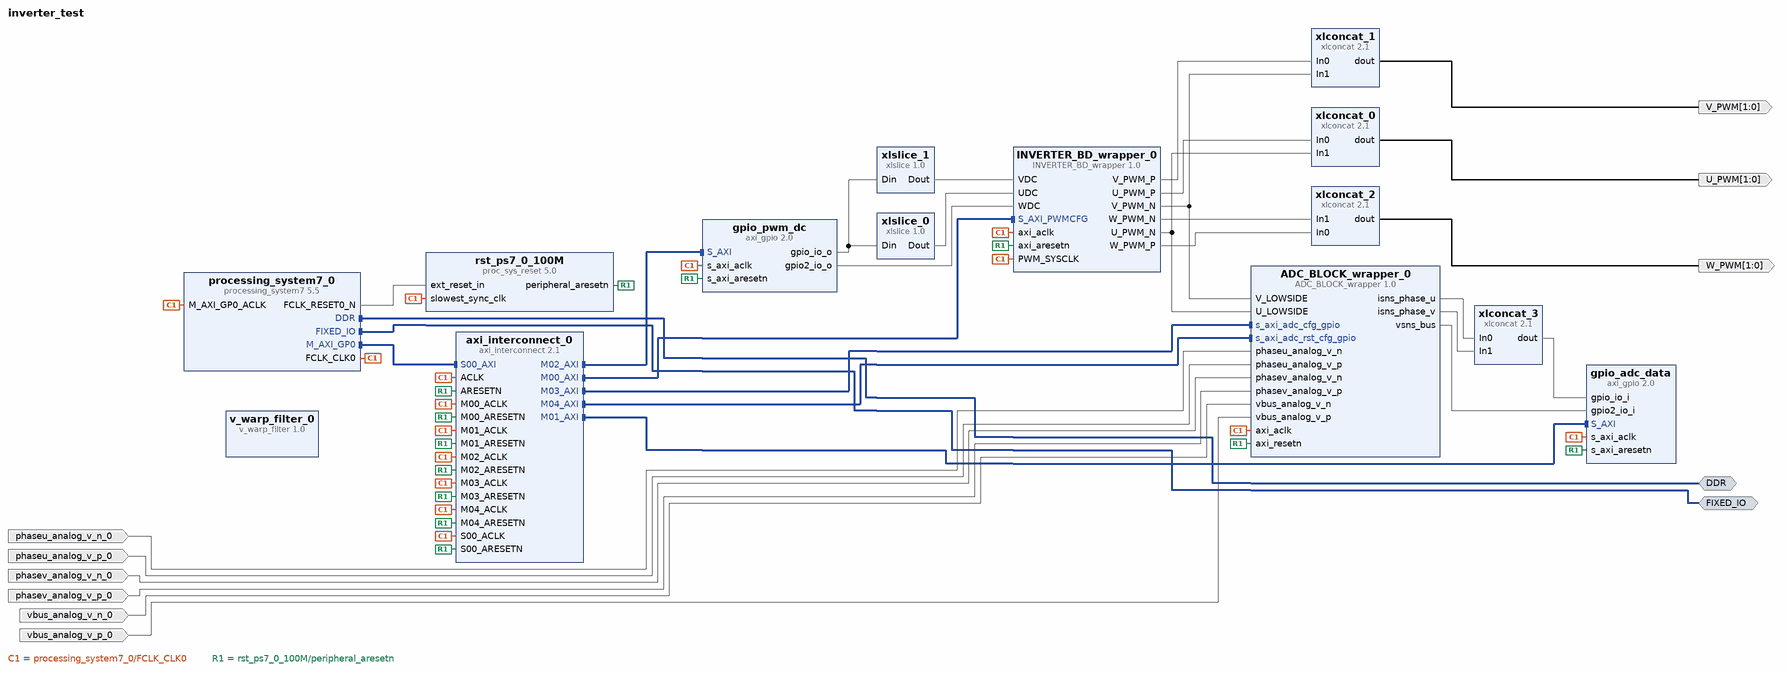
[diagram p0: block diagram of the top level]
# Vivado block design inverter_test, xc7z020clg400-1, Vivado 2021.2
create_bd_design inverter_test

create_bd_intf_port -mode Master -vlnv xilinx.com:interface:ddrx_rtl:1.0 DDR
create_bd_intf_port -mode Master -vlnv xilinx.com:display_processing_system7:fixedio_rtl:1.0 FIXED_IO
create_bd_port -dir O -from 1 -to 0 U_PWM
create_bd_port -dir O -from 1 -to 0 V_PWM
create_bd_port -dir O -from 1 -to 0 W_PWM
create_bd_port -dir I vbus_analog_v_n_0
create_bd_port -dir I phasev_analog_v_p_0
create_bd_port -dir I phasev_analog_v_n_0
create_bd_port -dir I phaseu_analog_v_p_0
create_bd_port -dir I phaseu_analog_v_n_0
create_bd_port -dir I vbus_analog_v_p_0

create_bd_cell -type ip -vlnv xilinx.com:user:INVERTER_BD_wrapper:1.0 INVERTER_BD_wrapper_0
create_bd_cell -type ip -vlnv xilinx.com:ip:xlconcat:2.1 xlconcat_0
create_bd_cell -type ip -vlnv xilinx.com:ip:xlconcat:2.1 xlconcat_1
create_bd_cell -type ip -vlnv xilinx.com:ip:xlconcat:2.1 xlconcat_2
create_bd_cell -type ip -vlnv xilinx.com:ip:processing_system7:5.5 processing_system7_0
set_property -dict [list \
  CONFIG.PCW_APU_PERIPHERAL_FREQMHZ 650 \
  CONFIG.PCW_CRYSTAL_PERIPHERAL_FREQMHZ 50 \
  CONFIG.PCW_ENET0_ENET0_IO {MIO 16 .. 27} \
  CONFIG.PCW_ENET0_GRP_MDIO_ENABLE 1 \
  CONFIG.PCW_ENET0_GRP_MDIO_IO {MIO 52 .. 53} \
  CONFIG.PCW_ENET0_PERIPHERAL_ENABLE 1 \
  CONFIG.PCW_ENET0_RESET_ENABLE 1 \
  CONFIG.PCW_ENET0_RESET_IO {MIO 9} \
  CONFIG.PCW_ENET_RESET_ENABLE 1 \
  CONFIG.PCW_ENET_RESET_SELECT {Share reset pin} \
  CONFIG.PCW_FPGA0_PERIPHERAL_FREQMHZ 100 \
  CONFIG.PCW_FPGA1_PERIPHERAL_FREQMHZ 50 \
  CONFIG.PCW_GPIO_MIO_GPIO_ENABLE 1 \
  CONFIG.PCW_GPIO_MIO_GPIO_IO MIO \
  CONFIG.PCW_I2C_RESET_ENABLE 1 \
  CONFIG.PCW_M_AXI_GP0_FREQMHZ 10 \
  CONFIG.PCW_PERIPHERAL_BOARD_PRESET None \
  CONFIG.PCW_PRESET_BANK1_VOLTAGE {LVCMOS 1.8V} \
  CONFIG.PCW_QSPI_GRP_FBCLK_ENABLE 1 \
  CONFIG.PCW_QSPI_GRP_FBCLK_IO {MIO 8} \
  CONFIG.PCW_QSPI_GRP_SINGLE_SS_ENABLE 1 \
  CONFIG.PCW_QSPI_GRP_SINGLE_SS_IO {MIO 1 .. 6} \
  CONFIG.PCW_QSPI_PERIPHERAL_ENABLE 1 \
  CONFIG.PCW_QSPI_QSPI_IO {MIO 1 .. 6} \
  CONFIG.PCW_SD0_GRP_CD_ENABLE 1 \
  CONFIG.PCW_SD0_GRP_CD_IO {MIO 47} \
  CONFIG.PCW_SD0_GRP_WP_ENABLE 0 \
  CONFIG.PCW_SD0_PERIPHERAL_ENABLE 1 \
  CONFIG.PCW_SD0_SD0_IO {MIO 40 .. 45} \
  CONFIG.PCW_SDIO_PERIPHERAL_FREQMHZ 50 \
  CONFIG.PCW_SINGLE_QSPI_DATA_MODE x4 \
  CONFIG.PCW_UART0_PERIPHERAL_ENABLE 1 \
  CONFIG.PCW_UART0_UART0_IO {MIO 14 .. 15} \
  CONFIG.PCW_UART1_PERIPHERAL_ENABLE 0 \
  CONFIG.PCW_UART_PERIPHERAL_FREQMHZ 100 \
  CONFIG.PCW_UIPARAM_DDR_BUS_WIDTH {16 Bit} \
  CONFIG.PCW_UIPARAM_DDR_FREQ_MHZ 525 \
  CONFIG.PCW_UIPARAM_DDR_PARTNO {MT41J256M16 RE-125} \
  CONFIG.PCW_USB0_PERIPHERAL_ENABLE 1 \
  CONFIG.PCW_USB0_RESET_ENABLE 1 \
  CONFIG.PCW_USB0_RESET_IO {MIO 46} \
  CONFIG.PCW_USB0_USB0_IO {MIO 28 .. 39} \
  CONFIG.PCW_USB_RESET_ENABLE 1 \
  CONFIG.PCW_USB_RESET_SELECT {Share reset pin} \
] [get_bd_cells processing_system7_0]
# 481 more settings of processing_system7_0 are not shown: defaults, MIO pin electricals, DDR timing, and values the tool derives
create_bd_cell -type ip -vlnv xilinx.com:ip:axi_interconnect:2.1 axi_interconnect_0
set_property -dict {CONFIG.NUM_MI 5} [get_bd_cells axi_interconnect_0]
create_bd_cell -type ip -vlnv xilinx.com:ip:proc_sys_reset:5.0 rst_ps7_0_100M
create_bd_cell -type ip -vlnv xilinx.com:ip:axi_gpio:2.0 gpio_adc_data
set_property -dict [list \
  CONFIG.C_ALL_INPUTS 1 \
  CONFIG.C_ALL_INPUTS_2 1 \
  CONFIG.C_GPIO2_WIDTH 16 \
  CONFIG.C_IS_DUAL 1 \
] [get_bd_cells gpio_adc_data]
create_bd_cell -type ip -vlnv xilinx.com:ip:xlconcat:2.1 xlconcat_3
create_bd_cell -type ip -vlnv xilinx.com:ip:axi_gpio:2.0 gpio_pwm_dc
set_property -dict [list \
  CONFIG.C_ALL_OUTPUTS 1 \
  CONFIG.C_ALL_OUTPUTS_2 1 \
  CONFIG.C_GPIO2_WIDTH 16 \
  CONFIG.C_IS_DUAL 1 \
] [get_bd_cells gpio_pwm_dc]
create_bd_cell -type ip -vlnv xilinx.com:ip:xlslice:1.0 xlslice_0
set_property -dict {CONFIG.DIN_FROM 15 CONFIG.DOUT_WIDTH 16} [get_bd_cells xlslice_0]
create_bd_cell -type ip -vlnv xilinx.com:ip:xlslice:1.0 xlslice_1
set_property -dict {CONFIG.DIN_FROM 31 CONFIG.DIN_TO 16 CONFIG.DOUT_WIDTH 16} [get_bd_cells xlslice_1]
create_bd_cell -type ip -vlnv xilinx.com:user:ADC_BLOCK_wrapper:1.0 ADC_BLOCK_wrapper_0
create_bd_cell -type ip -vlnv xilinx.com:ip:v_warp_filter:1.0 v_warp_filter_0

# ---- connections ----

connect_bd_intf_net [get_bd_intf_pins axi_interconnect_0/S00_AXI] [get_bd_intf_pins processing_system7_0/M_AXI_GP0]
connect_bd_intf_net [get_bd_intf_pins axi_interconnect_0/M00_AXI] [get_bd_intf_pins INVERTER_BD_wrapper_0/S_AXI_PWMCFG]
connect_bd_intf_net [get_bd_intf_pins axi_interconnect_0/M01_AXI] [get_bd_intf_pins gpio_adc_data/S_AXI]
connect_bd_intf_net [get_bd_intf_pins axi_interconnect_0/M02_AXI] [get_bd_intf_pins gpio_pwm_dc/S_AXI]
connect_bd_intf_net [get_bd_intf_pins axi_interconnect_0/M03_AXI] [get_bd_intf_pins ADC_BLOCK_wrapper_0/s_axi_adc_cfg_gpio]
connect_bd_intf_net [get_bd_intf_pins axi_interconnect_0/M04_AXI] [get_bd_intf_pins ADC_BLOCK_wrapper_0/s_axi_adc_rst_cfg_gpio]
connect_bd_intf_net [get_bd_intf_ports DDR] [get_bd_intf_pins processing_system7_0/DDR]
connect_bd_intf_net [get_bd_intf_ports FIXED_IO] [get_bd_intf_pins processing_system7_0/FIXED_IO]
connect_bd_net [get_bd_pins ADC_BLOCK_wrapper_0/isns_phase_u] [get_bd_pins xlconcat_3/In0]
connect_bd_net [get_bd_pins ADC_BLOCK_wrapper_0/isns_phase_v] [get_bd_pins xlconcat_3/In1]
connect_bd_net [get_bd_pins ADC_BLOCK_wrapper_0/vsns_bus] [get_bd_pins gpio_adc_data/gpio2_io_i]
connect_bd_net [get_bd_pins INVERTER_BD_wrapper_0/U_PWM_N] [get_bd_pins xlconcat_0/In1] [get_bd_pins ADC_BLOCK_wrapper_0/U_LOWSIDE]
connect_bd_net [get_bd_pins INVERTER_BD_wrapper_0/U_PWM_P] [get_bd_pins xlconcat_0/In0]
connect_bd_net [get_bd_pins INVERTER_BD_wrapper_0/V_PWM_N] [get_bd_pins xlconcat_1/In1] [get_bd_pins ADC_BLOCK_wrapper_0/V_LOWSIDE]
connect_bd_net [get_bd_pins INVERTER_BD_wrapper_0/V_PWM_P] [get_bd_pins xlconcat_1/In0]
connect_bd_net [get_bd_pins INVERTER_BD_wrapper_0/W_PWM_N] [get_bd_pins xlconcat_2/In1]
connect_bd_net [get_bd_pins INVERTER_BD_wrapper_0/W_PWM_P] [get_bd_pins xlconcat_2/In0]
connect_bd_net [get_bd_pins processing_system7_0/FCLK_CLK0] \
  [get_bd_pins INVERTER_BD_wrapper_0/axi_aclk] [get_bd_pins INVERTER_BD_wrapper_0/PWM_SYSCLK] \
  [get_bd_pins rst_ps7_0_100M/slowest_sync_clk] [get_bd_pins axi_interconnect_0/ACLK] \
  [get_bd_pins axi_interconnect_0/M00_ACLK] [get_bd_pins axi_interconnect_0/S00_ACLK] \
  [get_bd_pins processing_system7_0/M_AXI_GP0_ACLK] [get_bd_pins gpio_adc_data/s_axi_aclk] \
  [get_bd_pins axi_interconnect_0/M01_ACLK] [get_bd_pins gpio_pwm_dc/s_axi_aclk] [get_bd_pins axi_interconnect_0/M02_ACLK] \
  [get_bd_pins ADC_BLOCK_wrapper_0/axi_aclk] [get_bd_pins axi_interconnect_0/M03_ACLK] \
  [get_bd_pins axi_interconnect_0/M04_ACLK]
connect_bd_net [get_bd_pins gpio_pwm_dc/gpio2_io_o] [get_bd_pins INVERTER_BD_wrapper_0/WDC]
connect_bd_net [get_bd_pins gpio_pwm_dc/gpio_io_o] [get_bd_pins xlslice_0/Din] [get_bd_pins xlslice_1/Din]
connect_bd_net -net phaseu_analog_v_n_0_1 [get_bd_ports phaseu_analog_v_n_0] [get_bd_pins ADC_BLOCK_wrapper_0/phaseu_analog_v_n]
connect_bd_net -net phaseu_analog_v_p_0_1 [get_bd_ports phaseu_analog_v_p_0] [get_bd_pins ADC_BLOCK_wrapper_0/phaseu_analog_v_p]
connect_bd_net -net phasev_analog_v_n_0_1 [get_bd_ports phasev_analog_v_n_0] [get_bd_pins ADC_BLOCK_wrapper_0/phasev_analog_v_n]
connect_bd_net -net phasev_analog_v_p_0_1 [get_bd_ports phasev_analog_v_p_0] [get_bd_pins ADC_BLOCK_wrapper_0/phasev_analog_v_p]
connect_bd_net [get_bd_pins processing_system7_0/FCLK_RESET0_N] [get_bd_pins rst_ps7_0_100M/ext_reset_in]
connect_bd_net [get_bd_pins rst_ps7_0_100M/peripheral_aresetn] \
  [get_bd_pins INVERTER_BD_wrapper_0/axi_aresetn] [get_bd_pins axi_interconnect_0/ARESETN] \
  [get_bd_pins axi_interconnect_0/M00_ARESETN] [get_bd_pins axi_interconnect_0/S00_ARESETN] \
  [get_bd_pins gpio_adc_data/s_axi_aresetn] [get_bd_pins axi_interconnect_0/M01_ARESETN] \
  [get_bd_pins gpio_pwm_dc/s_axi_aresetn] [get_bd_pins axi_interconnect_0/M02_ARESETN] \
  [get_bd_pins ADC_BLOCK_wrapper_0/axi_resetn] [get_bd_pins axi_interconnect_0/M03_ARESETN] \
  [get_bd_pins axi_interconnect_0/M04_ARESETN]
connect_bd_net -net vbus_analog_v_n_0_1 [get_bd_ports vbus_analog_v_n_0] [get_bd_pins ADC_BLOCK_wrapper_0/vbus_analog_v_n]
connect_bd_net -net vbus_analog_v_p_0_1 [get_bd_ports vbus_analog_v_p_0] [get_bd_pins ADC_BLOCK_wrapper_0/vbus_analog_v_p]
connect_bd_net [get_bd_pins xlconcat_0/dout] [get_bd_ports U_PWM]
connect_bd_net [get_bd_pins xlconcat_1/dout] [get_bd_ports V_PWM]
connect_bd_net [get_bd_pins xlconcat_2/dout] [get_bd_ports W_PWM]
connect_bd_net [get_bd_pins xlconcat_3/dout] [get_bd_pins gpio_adc_data/gpio_io_i]
connect_bd_net [get_bd_pins xlslice_0/Dout] [get_bd_pins INVERTER_BD_wrapper_0/UDC]
connect_bd_net [get_bd_pins xlslice_1/Dout] [get_bd_pins INVERTER_BD_wrapper_0/VDC]

# ---- address map ----
assign_bd_address -offset 0x41200000 -range 64K -target_address_space [get_bd_addr_spaces processing_system7_0/Data] [get_bd_addr_segs gpio_adc_data/S_AXI/Reg]
assign_bd_address -offset 0x41210000 -range 64K -target_address_space [get_bd_addr_spaces processing_system7_0/Data] [get_bd_addr_segs gpio_pwm_dc/S_AXI/Reg]
assign_bd_address -offset 0x43C00000 -range 64K -target_address_space [get_bd_addr_spaces processing_system7_0/Data] [get_bd_addr_segs INVERTER_BD_wrapper_0/S_AXI_PWMCFG/reg0]
assign_bd_address -offset 0x43C10000 -range 64K -target_address_space [get_bd_addr_spaces processing_system7_0/Data] [get_bd_addr_segs ADC_BLOCK_wrapper_0/s_axi_adc_cfg_gpio/reg0]
assign_bd_address -offset 0x43C20000 -range 64K -target_address_space [get_bd_addr_spaces processing_system7_0/Data] [get_bd_addr_segs ADC_BLOCK_wrapper_0/s_axi_adc_rst_cfg_gpio/reg0]

validate_bd_design
save_bd_design
